# EAGLE schematic mini (EAGLE 6.2)
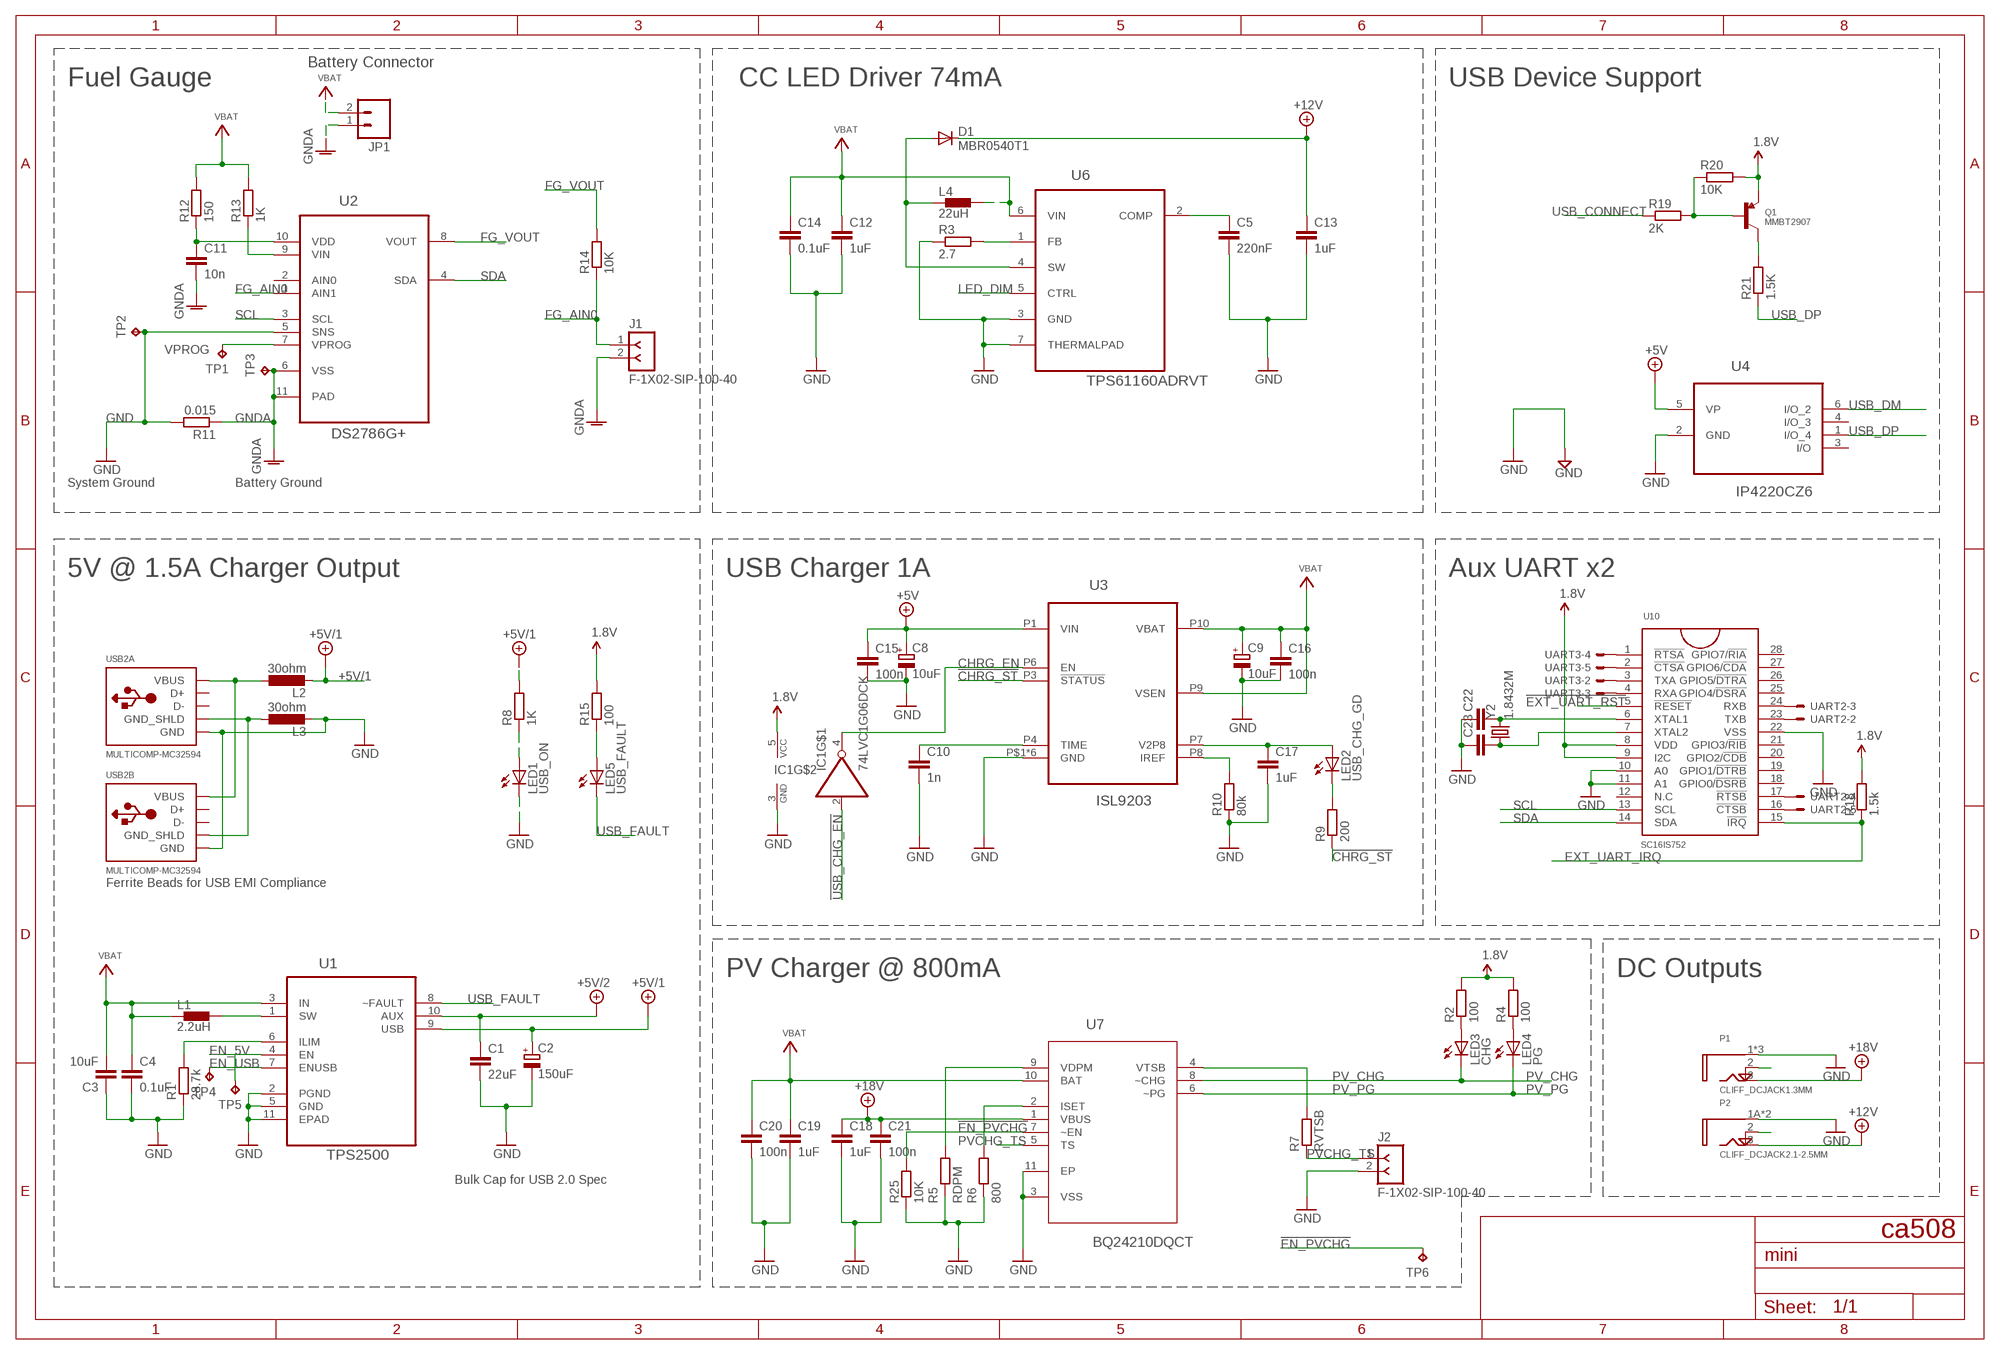
[diagram p0: schematic, sheet 1, part 1 of 2]
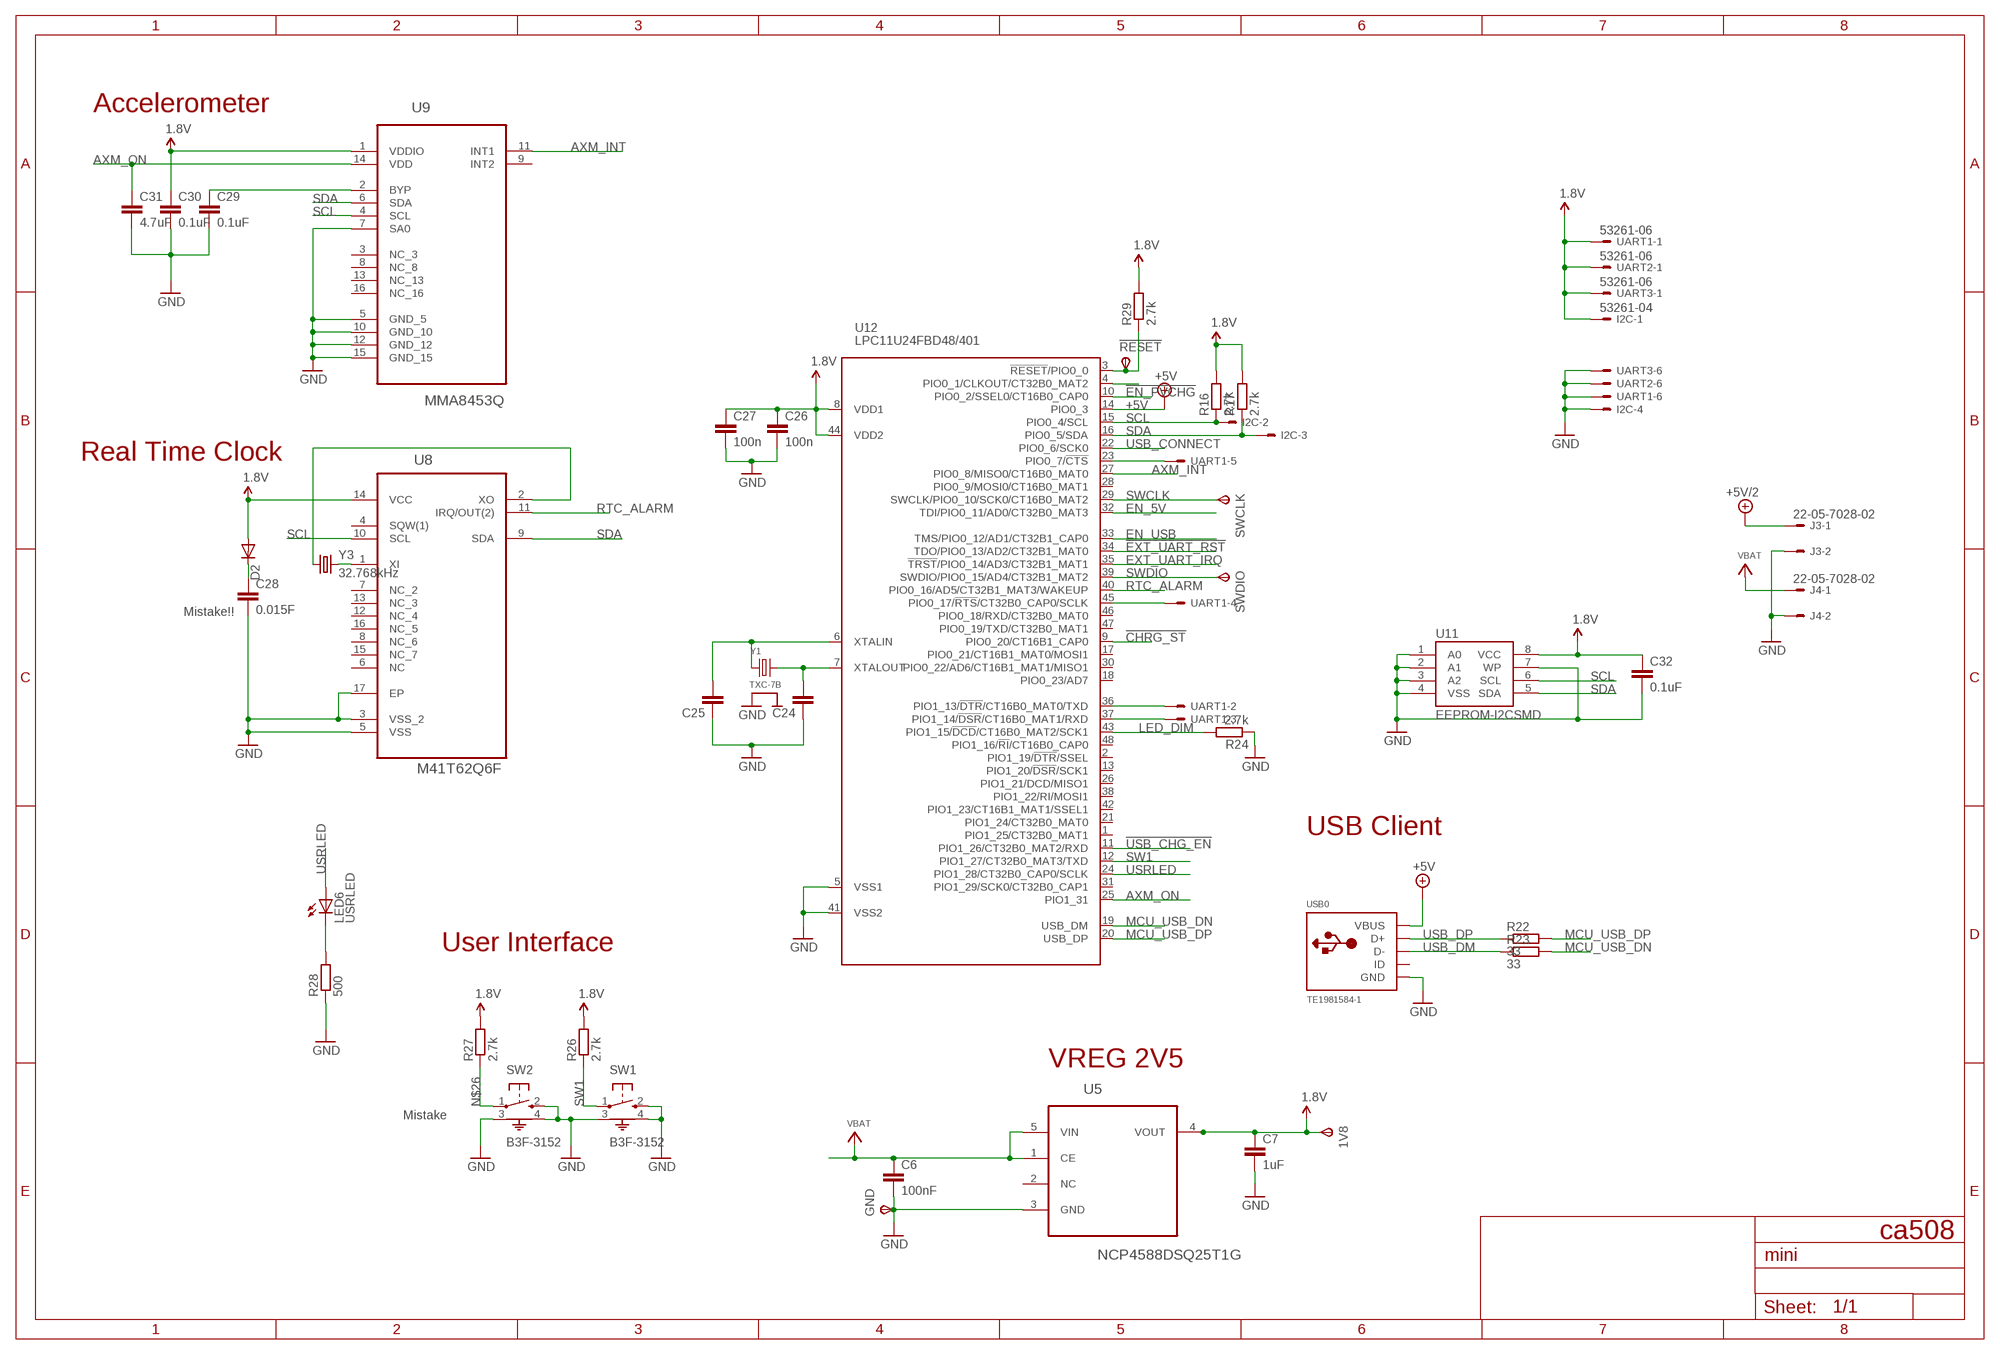
[diagram p1: schematic, sheet 1, part 2 of 2]

## Parts
1V8  TPSTP13SQ  [TP13SQ]
!RESET!  TPSTP13SQ  [TP13SQ]
C1  22uF  C-EUC1210  [C1210]
C2  150uF  CPOL-EUD  [PANASONIC_D]
C3  10uF  C-EUC0805  [C0805]
C4  0.1uF  C-EUC0603  [C0603]
C5  220nF  C-EUC0603  [C0603]
C6  100nF  C-EUC0805  [C0805]
C7  1uF  C-EUC1206  [C1206]
C8  10uF  CPOL-EUB/3528-21R  [B/3528-21R]
C9  10uF  CPOL-EUB/3528-21R  [B/3528-21R]
C10  1n  C-EUC0603  [C0603]
C11  10n  C-EUC0603  [C0603]
C12  1uF  C-EUC0603  [C0603]
C13  1uF  C-EUC0805  [C0805]
C14  0.1uF  C-EUC0603  [C0603]
C15  100n  C-EUC0603  [C0603]
C16  100n  C-EUC0603  [C0603]
C17  1uF  C-EUC0805  [C0805]
C18  1uF  C-EUC0805  [C0805]
C19  1uF  C-EUC0805  [C0805]
C20  100n  C-EUC0603  [C0603]
C21  100n  C-EUC0603  [C0603]
C22  C-EUC0805  [C0805]
C23  C-EUC0805  [C0805]
C24  C-EUC0805  [C0805]
C25  C-EUC0805  [C0805]
C26  100n  C-EUC0603  [C0603]
C27  100n  C-EUC0603  [C0603]
C28  0.015F  C-EUC3225  [C3225]
C29  0.1uF  C-EUC0603  [C0603]
C30  0.1uF  C-EUC0603  [C0603]
C31  4.7uF  C-EUC0805  [C0805]
C32  0.1uF  C-EUC0603  [C0603]
D1  MBR0540T1  MBR0520LT  [SOD123]
D2  DIODE-SOD123  [SOD123]
GND  TPSTP13SQ  [TP13SQ]
I2C  53261-04  [53261-04]
IC1  74LVC1G06DCK  [SC70-5]
J1  F-1X02-SIP-100-40  [SIP-100-02-40]
J2  F-1X02-SIP-100-40  [SIP-100-02-40]
J3  22-05-7028-02  [7395-02]
J4  22-05-7028-02  [7395-02]
JP1  M02-JST-2MM-SMT  [JST-2-SMD]
L1  2.2uH  SDR1006-XXXKL  [SDR1006]
L2  30ohm  L-EUL3216C  [L3216C]
L3  30ohm  L-EUL3216C  [L3216C]
L4  22uH  VLCF5020-1  [VLCF-SERIES]
LED1  USB_ON  LEDCHIP-LED0603  [CHIP-LED0603]
LED2  USB_CHG_GD  LEDCHIP-LED0603  [CHIP-LED0603]
LED3  CHG  LEDCHIP-LED0603  [CHIP-LED0603]
LED4  PG  LEDCHIP-LED0603  [CHIP-LED0603]
LED5  USB_FAULT  LEDCHIP-LED0603  [CHIP-LED0603]
LED6  USRLED  LEDCHIP-LED0603  [CHIP-LED0603]
P1  CLIFF_DCJACK1.3MM  [FC68145S]
P2  CLIFF_DCJACK2.1-2.5MM  [FC6814XS]
Q1  MMBT2907  TRANSISTOR_PNPSOT23-REFLOW  [SOT23-R]
R1  28.7k  R-EU_R0805  [R0805]
R2  100  R-EU_R0603  [R0603]
R3  2.7  R-EU_R0603  [R0603]
R4  100  R-EU_R0603  [R0603]
R5  RDPM  R-EU_R0805  [R0805]
R6  800  R-EU_R0805  [R0805]
R7  RVTSB  R-EU_R0805  [R0805]
R8  1K  R-EU_R0603  [R0603]
R9  200  R-EU_R0603  [R0603]
R10  80k  R-EU_R0805  [R0805]
R11  0.015  R-EU_R2512  [R2512]
R12  150  R-EU_R0805  [R0805]
R13  1K  R-EU_R0805  [R0805]
R14  10K  R-EU_R0805  [R0805]
R15  100  R-EU_R0603  [R0603]
R16  2.7k  R-EU_R0603  [R0603]
R17  2.7k  R-EU_R0603  [R0603]
R18  1.5k  R-EU_R0603  [R0603]
R19  2K  R-EU_R0603  [R0603]
R20  10K  R-EU_R0603  [R0603]
R21  1.5K  R-EU_R0603  [R0603]
R22  33  R-EU_R0603  [R0603]
R23  33  R-EU_R0603  [R0603]
R24  2.7k  R-EU_R0603  [R0603]
R25  10K  R-EU_R0603  [R0603]
R26  2.7k  R-EU_R0603  [R0603]
R27  2.7k  R-EU_R0603  [R0603]
R28  500  R-EU_R0603  [R0603]
R29  2.7k  R-EU_R0603  [R0603]
SW1  B3F-3152  [B3F-315X]
SW2  B3F-3152  [B3F-315X]
SWCLK  TPSTP13SQ  [TP13SQ]
SWDIO  TPSTP13SQ  [TP13SQ]
TP1  TPTP14R  [TP14R]
TP2  TPTP07R  [TP07R]
TP3  TPTP07R  [TP07R]
TP4  TPTP07R  [TP07R]
TP5  TPTP07R  [TP07R]
TP6  TPTP07R  [TP07R]
U1  TPS2500  TPS2500DRCT  [SON50P300X300X100-11N]
U2  DS2786G+  [DFN300X300X80-11N]
U3  ISL9203  [INTERSIL_DFN_3X3]
U4  IP4220CZ6  [SOT95P275X110-6N]
U5  NCP4588DSQ25T1G  [SOT65P210X110-5N]
U6  TPS61160ADRVT  [SON65P210X210X80-7N]
U7  BQ24210DQCT  [SON50P200X300X80-11N]
U8  M41T62Q6F  [QFN50P300X300X100-17N]
U9  MMA8453Q  [QFN50P300X300X100-16N]
U10  SC16IS752  [TSSOP28]
U11  EEPROM-I2CSMD  [SO08]
U12  LPC11U24FBD48/401  [LQFP48]
UART1  53261-06  [53261-06]
UART2  53261-06  [53261-06]
UART3  53261-06  [53261-06]
USB0  TE1981584-1  [TE-MICROUSB-AB]
USB2  MULTICOMP-MC32594  [MC32594]
Y1  TXC-7B  [TXC-7B]
Y2  1.8432M  CRYSTALHC49UV  [HC49U-V]
Y3  32.768kHz  CRYSTAL32-SMD  [CRYSTAL-32KHZ-SMD]

## Nets
1.8V: 1V8.TP(PP) C7.1 C26.1 C27.1 C30.1 C32.1 D2.A I2C.1 IC1.5(VCC) Q1.2(E) R2.2 R4.2 R15.2 R16.2 R17.2 R18.2 R20.2 R26.2 R27.2 R29.2 U5.4(VOUT) U8.14(VCC) U9.1(VDDIO) U10.8(VDD) U10.9(I2C) U11.8(VCC) U12.8(VDD1) U12.44(VDD2) UART1.1 UART2.1 UART3.1
!CHRG_ST!: R9.1 U3.P3(!STATUS!) U12.9(PIO0_20/CT16B1_CAP0)
!EN_PVCHG!: R25.2 TP6.TP U7.7(~EN) U12.10(PIO0_2/SSEL0/CT16B0_CAP0)
!EXT_UART_RST!: U10.5(!RESET!) U12.34(TDO/PIO0_13/AD2/CT32B1_MAT0)
!USB_CHG_EN!: IC1.2(I) U12.11(PIO1_26/CT32B0_MAT2/RXD)
+5V: C8.+ C15.1 U3.P1(VIN) U4.5(VP) U12.14(PIO0_3) USB0.P1(VBUS)
+5V/1: C2.+ L2.2 R8.2 U1.9(USB)
+5V/2: C1.1 J3.1 U1.10(AUX)
+12V: C13.1 D1.C P2.3(TIP)
+18V: C18.1 C21.1 P1.3(TIP) U7.1(VBUS)
AXM_INT: U9.11(INT1) U12.27(PIO0_8/MISO0/CT16B0_MAT0)
AXM_ON: C31.1 U9.14(VDD) U12.25(PIO1_31)
CHRG_EN: IC1.4(O) U3.P6(EN)
EN_5V: TP5.TP U1.4(EN) U12.32(TDI/PIO0_11/AD0/CT32B0_MAT3)
EN_USB: TP4.TP U1.7(ENUSB) U12.33(TMS/PIO0_12/AD1/CT32B1_CAP0)
EXT_UART_IRQ: R18.1 U10.15(!IRQ!) U12.35(!TRST!/PIO0_14/AD3/CT32B1_MAT1)
FG_AIN0: J1.1 R14.1 U2.1(AIN1)
FG_VOUT: R14.2 U2.8(VOUT)
GND: C1.2 C2.- C3.1 C4.2 C5.2 C6.2 C7.2 C8.- C9.- C10.2 C12.2 C13.2 C14.2 C15.2 C16.2 C17.2 C18.2 C19.2 C20.2 C21.2 C22.1 C23.1 C24.1 C25.1 C26.2 C27.2 C28.2 C29.2 C30.2 C31.2 C32.2 GND.TP(PP) I2C.4 IC1.3(GND) J2.2 J3.2 J4.2 L3.2 LED1.C P1.1(SLEEVE) P1.4A(SLEEVE) P1.4B(SLEEVE) P2.1A(SLEEVE) P2.1B(SLEEVE) R1.1 R3.1 R5.1 R6.1 R10.1 R11.2 R24.1 R25.1 R28.1 SW1.2 SW1.3 SW1.4 SW2.2 SW2.3 SW2.4 TP2.TP U1.2(PGND) U1.5(GND) U1.11(EPAD) U2.5(SNS) U3.P5(GND) U3.P$1(GND) U3.P$2(GND) U3.P$3(GND) U3.P$4(GND) U3.PAD(GND) U4.2(GND) U5.3(GND) U6.3(GND) U6.7(THERMALPAD) U7.3(VSS) U7.11(EP) U8.3(VSS_2) U8.5(VSS) U8.17(EP) U9.5(GND_5) U9.7(SA0) U9.10(GND_10) U9.12(GND_12) U9.15(GND_15) U10.10(A0) U10.11(A1) U10.22(VSS) U11.1(A0) U11.2(A1) U11.3(A2) U11.4(VSS) U11.7(WP) U12.5(VSS1) U12.41(VSS2) UART1.6 UART2.6 UART3.6 USB0.P5(GND) USB2.USB1-4(A:GND) USB2.USB2-4(B:GND) Y1.2 Y1.4
GNDA: C11.2 J1.2 JP1.1 R11.1 TP3.TP U2.6(VSS) U2.11(PAD)
LED_DIM: R24.2 U6.5(CTRL) U12.43(PIO1_15/!DCD!/CT16B0_MAT2/SCK1)
MCU_USB_DN: R23.2 U12.19(USB_DM)
MCU_USB_DP: R22.2 U12.20(USB_DP)
N$1: L1.P$2 U1.1(SW)
N$2: C11.1 R12.1 U2.10(VDD)
N$3: R10.2 U3.P8(IREF)
N$4: L2.1 USB2.USB1-1(A:VBUS) USB2.USB2-1(B:VBUS)
N$5: C10.1 U3.P4(TIME)
N$6: L3.1 USB2.P$1(A:GND_SHLD) USB2.P$2(A:GND_SHLD) USB2.P$3(B:GND_SHLD) USB2.P$4(B:GND_SHLD)
N$7: LED1.A R8.1
N$8: R13.1 U2.9(VIN)
N$9: LED2.C R9.2
N$10: R1.2 U1.6(ILIM)
N$11: D1.A L4.1 U6.4(SW)
N$12: C17.1 LED2.A U3.P7(V2P8)
N$13: C5.1 U6.2(COMP)
N$14: R3.2 U6.1(FB)
N$15: R7.2 U7.4(VTSB)
N$16: C28.1 D2.C
N$17: R5.2 U7.9(VDPM)
N$18: R6.2 U7.2(ISET)
N$19: LED5.A R15.1
N$20: P2.2(SHUNT)
N$21: LED4.A R4.1
N$22: LED3.A R2.1
N$23: P1.2(SHUNT)
N$24: Q1.1(B) R19.2 R20.1
N$25: C22.2 U10.6(XTAL1) Y2.2
N$26: R27.1 SW2.1
N$27: C24.2 U12.7(XTALOUT) Y1.3
N$28: C25.2 U12.6(XTALIN) Y1.1
N$29: LED6.C R28.2
N$30: U10.3(TXA) UART3.2
N$31: C23.2 U10.7(XTAL2) Y2.1
N$32: U10.4(RXA) UART3.3
N$33: U10.23(TXB) UART2.2
N$34: U10.24(RXB) UART2.3
N$35: U10.17(!RTSB!) UART2.4
N$36: U10.16(!CTSB!) UART2.5
N$37: U10.2(!CTSA!) UART3.5
N$38: U10.1(!RTSA!) UART3.4
N$39: U12.36(PIO1_13/!DTR!/CT16B0_MAT0/TXD) UART1.2
N$40: U12.37(PIO1_14/!DSR!/CT16B0_MAT1/RXD) UART1.3
N$41: U12.45(PIO0_17/!RTS!/CT32B0_CAP0/SCLK) UART1.4
N$42: U12.23(PIO0_7/!CTS!) UART1.5
N$43: U12.4(PIO0_1/CLKOUT/CT32B0_MAT2)
N$44: U8.2(XO) Y3.X1
N$45: Q1.3(C) R21.2
N$46: U8.1(XI) Y3.X2
N$48: !RESET!.TP(PP) R29.1 U12.3(!RESET!/PIO0_0)
N$52: C29.1 U9.2(BYP)
PV_CHG: LED3.C U7.8(~CHG)
PV_PG: LED4.C U7.6(~PG)
PVCHG_TS: J2.1 R7.1 U7.5(TS)
RTC_ALARM: U8.11(IRQ/OUT(2)) U12.40(PIO0_16/AD5/CT32B1_MAT3/WAKEUP)
SCL: I2C.2 R16.1 U2.3(SCL) U8.10(SCL) U9.4(SCL) U10.13(SCL) U11.6(SCL) U12.15(PIO0_4/SCL)
SDA: I2C.3 R17.1 U2.4(SDA) U8.9(SDA) U9.6(SDA) U10.14(SDA) U11.5(SDA) U12.16(PIO0_5/SDA)
SW1: R26.1 SW1.1 U12.12(PIO1_27/CT32B0_MAT3/TXD)
SWCLK: SWCLK.TP(PP) U12.29(SWCLK/PIO0_10/SCK0/CT16B0_MAT2)
SWDIO: SWDIO.TP(PP) U12.39(SWDIO/PIO0_15/AD4/CT32B1_MAT2)
USB_CONNECT: R19.1 U12.22(PIO0_6/SCK0)
USB_DM: R23.1 U4.6(I/O_2) USB0.P2(D-)
USB_DP: R21.1 R22.1 U4.1(I/O_4) USB0.P3(D+)
USB_FAULT: LED5.C U1.8(~FAULT)
USRLED: LED6.A U12.24(PIO1_28/CT32B0_CAP0/SCLK)
VBAT: C3.2 C4.1 C6.1 C9.+ C12.1 C14.1 C16.1 C19.1 C20.1 J4.1 JP1.2 L1.P$1 L4.2 R12.2 R13.2 U1.3(IN) U3.P9(VSEN) U3.P10(VBAT) U5.1(CE) U5.5(VIN) U6.6(VIN) U7.10(BAT)
VPROG: TP1.TP U2.7(VPROG)
Unconnected: U2.2(AIN0) U4.3(I/O) U4.4(I/O_3) U5.2(NC) U8.4(SQW(1)) U8.6(NC) U8.7(NC_2) U8.8(NC_6) U8.12(NC_4) U8.13(NC_3) U8.15(NC_7) U8.16(NC_5) U9.3(NC_3) U9.8(NC_8) U9.9(INT2) U9.13(NC_13) U9.16(NC_16) U10.12(N.C) U10.18(GPIO0/!DSRB!) U10.19(GPIO1/!DTRB!) U10.20(GPIO2/!CDB!) U10.21(GPIO3/!RIB!) U10.25(GPIO4/!DSRA!) U10.26(GPIO5/!DTRA!) U10.27(GPIO6/!CDA!) U10.28(GPIO7/!RIA!) U12.1(PIO1_25/CT32B0_MAT1) U12.2(PIO1_19/!DTR!/SSEL) U12.13(PIO1_20/!DSR!/SCK1) U12.17(PIO0_21/CT16B1_MAT0/MOSI1) U12.18(PIO0_23/AD7) U12.21(PIO1_24/CT32B0_MAT0) U12.26(PIO1_21/DCD/MISO1) U12.28(PIO0_9/MOSI0/CT16B0_MAT1) U12.30(PIO0_22/AD6/CT16B1_MAT1/MISO1) U12.31(PIO1_29/SCK0/CT32B0_CAP1) U12.38(PIO1_22/RI/MOSI1) U12.42(PIO1_23/CT16B1_MAT1/SSEL1) U12.46(PIO0_18/RXD/CT32B0_MAT0) U12.47(PIO0_19/TXD/CT32B0_MAT1) U12.48(PIO1_16/!RI!/CT16B0_CAP0) USB0.P4(ID) USB2.USB1-2(A:D-) USB2.USB1-3(A:D+) USB2.USB2-2(B:D-) USB2.USB2-3(B:D+)

## Notes on the sheet
- Battery Connector
- Fuel Gauge | CC LED Driver 74mA | USB Device Support
- System Ground | Battery Ground
- 5V @ 1.5A Charger Output | USB Charger 1A | Aux UART x2
- Ferrite Beads for USB EMI Compliance
- PV Charger @ 800mA | DC Outputs
- Bulk Cap for USB 2.0 Spec
- ca508
- Accelerometer
- Real Time Clock
- Mistake!!
- USB Client
- User Interface
- VREG 2V5
- Mistake
- ca508

## Library data of the parts
1V8 !RESET! GND SWCLK SWDIO = testpad:TPS: TEST PIN
C1 = resistor:C-EU: CAPACITOR, European symbol; FARNELL: 1907362
C2 = resistor:CPOL-EU: POLARIZED CAPACITOR, European symbol; FARNELL: 1850096
C3 = resistor:C-EU: CAPACITOR, European symbol; FARNELL: 1833812
C4-C7 C10 C11 C14-C17 C20-C32 = resistor:C-EU: CAPACITOR, European symbol
C8 C9 = resistor:CPOL-EU: POLARIZED CAPACITOR, European symbol; FARNELL: CA06845
C12 = resistor:C-EU: CAPACITOR, European symbol; FARNELL: 1828798
C13 C18 = resistor:C-EU: CAPACITOR, European symbol; FARNELL: 1735541
C19 = resistor:C-EU: CAPACITOR, European symbol; FARNELL: 1833845
D1 = diode:MBR0520LT: SCHOTTKY BARRIER RECTIFIER Source: http://onsemi.com .. MBR0520LT1-D.pdf; FARNELL: 9556923
D2 = diode:DIODE-: DIODE
I2C = con-molex:53?-04: CONNECTOR wire to board 1.25 mm (.049 inch) pitch header; OC_FARNELL: 1125374; OC_NEWARK: unknown
IC1 = 74xx-little-de:74*1G06: Single Inverter Buffer/Driver With Open-Drain Output
J1 J2 = con-headers-jp:F-1X02-: FEMALE HEADER
J3 J4 = con-molex:22-?-02: CONNECTOR wire to board 2.54 mm (.1 inch) pitch header; OC_FARNELL: 9731601; OC_NEWARK: unknown
JP1 = SparkFun-Connectors:M02: Header 2 Standard 2-pin 0.1" header. Use with straight break away headers (SKU : PRT-00116), right angle break away headers (PRT-00553), swiss pins (PRT-00743), machine pins (PRT-00117), and female headers (PRT-00115). Molex polarized connector foot print use with SKU : PRT-08233 with associated crimp pins and housings.
L1 = farnellparts:SDR1006-XXXKL; FARNELL: 1828074
L2 L3 = resistor:L-EU: INDUCTOR, European symbol; FARNELL: FT01179
L4 = minibox-parts:VLCF5020-1; FARNELL: 1670099
LED1-LED6 = led:LED: LED OSRAM: - CHIPLED LG R971, LG N971, LY N971, LG Q971, LY Q971, LO R971, LY R971 LH N974, LH R974 LS Q976, LO Q976, LY Q976 LO Q996 - Hyper CHIPLED LW Q18S LB Q993, LB Q99A, LB R99A - SideLED LS A670, LO A670, LY A670, LG A670, LP A670 LB A673, LV A673, LT A673, LW A673 LH A674 LY A675 LS A676, LA A676, LO A676, LY A676, LW A676 LS A679, LY A679, LG A679 - Hyper Micro SIDELED® LS Y876, LA Y876, LO Y876, LY Y876 LT Y87S - SmartLED LW L88C, LW L88S LB L89C, LB L89S, LG L890 LS L89K, LO L89K, LY L89K LS L896, LA L896, LO L896, LY L896 - TOPLED LS T670, LO T670, LY T670, LG T670, LP T670 LSG T670, LSP T670, LSY T670, LOP T670, LYG T670 LG T671, LOG T671, LSG T671 LB T673, LV T673, LT T673, LW T673 LH T674 LS T676, LA T676, LO T676, LY T676, LB T676, LH T676, LSB T676, LW T676 LB T67C, LV T67C, LT T67C, LS T67K, LO T67K, LY T67K, LW E67C LS E67B, LA E67B, LO E67B, LY E67B, LB E67C, LV E67C, LT E67C LW T67C LS T679, LY T679, LG T679 LS T770, LO T770, LY T770, LG T770, LP T770 LB T773, LV T773, LT T773, LW T773 LH T774 LS E675, LA E675, LY E675, LS T675 LS T776, LA T776, LO T776, LY T776, LB T776 LHGB T686 LT T68C, LB T68C - Hyper Mini TOPLED® LB M676 - Mini TOPLED Santana® LG M470 LS M47K, LO M47K, LY M47K Source: http://www.osram.convergy.de LUXEON: - LUMILED® LXK2-PW12-R00, LXK2-PW12-S00, LXK2-PW14-U00, LXK2-PW14-V00 LXK2-PM12-R00, LXK2-PM12-S00, LXK2-PM14-U00 LXK2-PE12-Q00, LXK2-PE12-R00, LXK2-PE12-S00, LXK2-PE14-T00, LXK2-PE14-U00 LXK2-PB12-K00, LXK2-PB12-L00, LXK2-PB12-M00, LXK2-PB14-N00, LXK2-PB14-P00, LXK2-PB14-Q00 LXK2-PR12-L00, LXK2-PR12-M00, LXK2-PR14-Q00, LXK2-PR14-R00 LXK2-PD12-Q00, LXK2-PD12-R00, LXK2-PD12-S00 LXK2-PH12-R00, LXK2-PH12-S00 LXK2-PL12-P00, LXK2-PL12-Q00, LXK2-PL12-R00 Source: www.luxeon.com KINGBRIGHT: KA-3528ASYC Source: www.kingbright.com
P1 P2 = minibox-parts:CLIFF_DCJACK
Q1 = microbuilder:TRANSISTOR_PNP: PNP Transistor Transistor (PNP) 800mA 60V, 1.6V VCE @ 500mA [Digikey: MMBT2907AFSTR-ND] Transistor (PNP) Low Sat - 1.5A 20V, 260mV VCE @ 400mA [Digikey: ZXTP25020DFLTR-ND] SOT23-R - SOT23 footprint optimised for use with solder paste and reflow ovens. SOT23-W - SOT23 footprint optimised for hand-soldering (larger pads).
R1 = resistor:R-EU_: RESISTOR, European symbol; FARNELL: 1160233
R2 R4-R10 R12-R29 = resistor:R-EU_: RESISTOR, European symbol
R3 = resistor:R-EU_: RESISTOR, European symbol; FARNELL: 1717778
R11 = resistor:R-EU_: RESISTOR, European symbol; FARNELL: 1107396
SW1 SW2 = minibox-parts:B3F-3152
TP1-TP6 = testpad:TP: Test pad
U1 = minibox-parts:TPS2500DRCT: INTEGRATED USB POWER SWITCH WITH BOOST CONVERTER; MPN: TPS2500DRCT; OC_FARNELL: 1774589; OC_NEWARK: 29R0268; PACKAGE: SON-10; SUPPLIER: Texas Instruments
U2 = minibox-parts:DS2786G+; DESCRIPTION: Stand-Alone OCV-Based Fuel Gauge; MPN: DS2786G+; OC_FARNELL: -; OC_NEWARK: 50M0907; PACKAGE: DFN-10; SUPPLIER: Maxim
U3 = minibox-parts:ISL9203: The ISL9203R5220 is an integrated single-cell Li-ion or Li-polymer battery charger capable of operating with an input voltage as low as 2.4V. This charger is designed to work with various types of AC adapters. Datasheet: Link <http://www.farnell.com/datasheets/71476.pdf> Intersil Layout Guidelines Link <http://www.intersil.com/data/tb/TB389.pdf>; FARNELL: 1361031
U4 = minibox-parts:IP4220CZ6: Dual Schmitt-Trigger Inverter; MPN: IP4220CZ6; OC_FARNELL: 1506629; OC_NEWARK: 61M6815; PACKAGE: SSOT-6; SUPPLIER: NXP
U5 = minibox-parts:NCP4588DSQ25T1G: Linear Voltage Regulator; MPN: NCP4588DSQ25T1G; OC_FARNELL: 1885132; OC_NEWARK: 41T0737; PACKAGE: SC70-5; SUPPLIER: ON SEMICONDUCTOR
U6 = EE4_EQNXMPPT_PARTS:TPS61160ADRVT: White LED Driver With PWM Brightness Control in 2mm x 2mm QFN Package for up to 10 LEDs in Series; MPN: TPS61160ADRVT; OC_FARNELL: 1735594; OC_NEWARK: 1735594; PACKAGE: SON-6; SUPPLIER: Texas Instruments
U7 = minibox-parts:BQ24210DQCT: Single Cell Li-Ion Battery Solar Charger; MPN: BQ24210DQCT; OC_FARNELL: 1903633; OC_NEWARK: 56T0491; PACKAGE: SON-10; SUPPLIER: TEXAS INSTRUMENTS
U8 = minibox-parts:M41T62Q6F: Serial real-time clocks with alarm; MPN: M41T62Q6F; OC_FARNELL: 1224441; OC_NEWARK: 56P9316; PACKAGE: QFN-16; SUPPLIER: STMICROELECTRONICS
U9 = farnellparts:MMA8453Q
U10 = farnellparts:SC16IS752
U11 = SparkFun-DigitalIC:EEPROM-I2C: I2C EEPROM chips, 24LC256 (and others)
U12 = minibox-parts:LPC11U24FBD48/401
UART1-UART3 = con-molex:53?-06: CONNECTOR wire to board 1.25 mm (.049 inch) pitch header; OC_FARNELL: 1125375; OC_NEWARK: unknown
USB0 = connectors-bbng:TE1981584-1
USB2 = connectors-bbng:MULTICOMP-MC32594
Y1 = minibox-parts:TXC-7B
Y2 Y3 = SparkFun-FreqCtrl:CRYSTAL: Various standard crystals. Proven footprints. Spark Fun Electronics SKU : COM-00534